# Altium schematic sheet RX_IO.SchDoc
size A; SheetNumber: 3; SheetTotal: 5
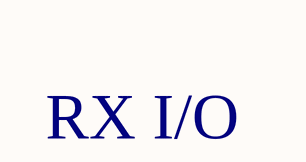
[diagram p0: RX_IO.SchDoc]

## Notes on the sheet
- RX I/O